# Altium schematic sheet connect.SchDoc
size A3
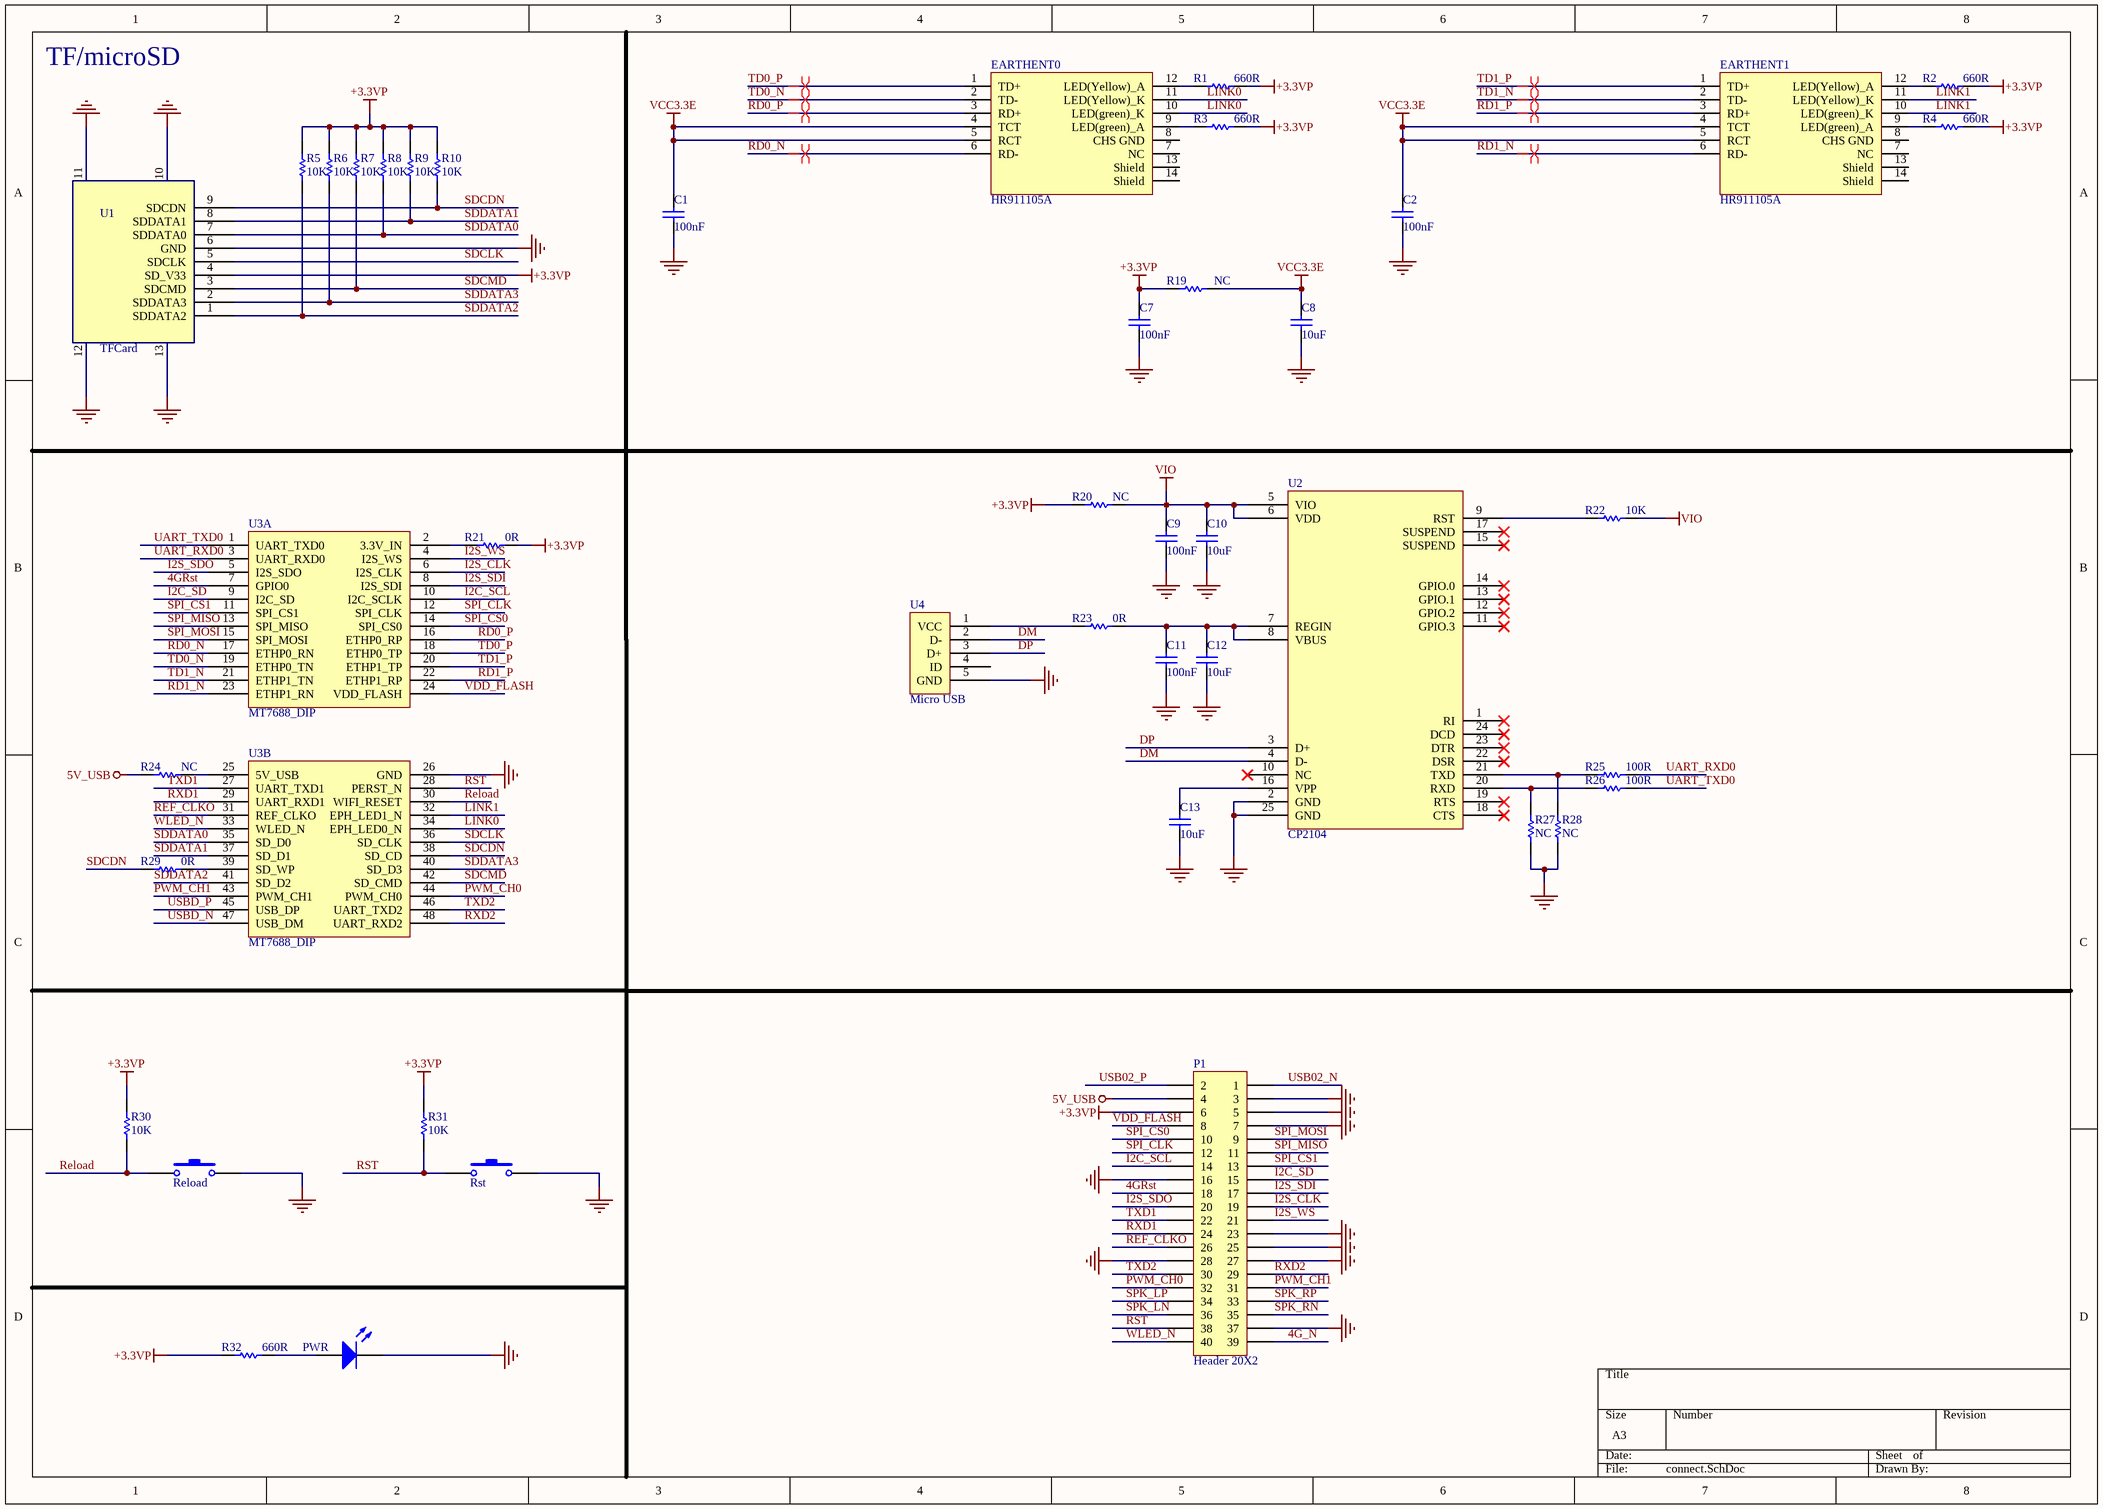
[diagram p0: connect.SchDoc]

## Parts
C1  value 100nF  [C0603L]  (hidden comment: Cap Semi)
C2  value 100nF  [C0603L]  (hidden comment: Cap Semi)
C7  value 100nF  [C0603L]  (hidden comment: Cap Semi)
C8  value 10uF  [C0603L]  (hidden comment: Cap Semi)
C9  value 100nF  [C0603L]  (hidden comment: Cap Semi)
C10  value 10uF  [C0603L]  (hidden comment: Cap Semi)
C11  value 100nF  [C0603L]  (hidden comment: Cap Semi)
C12  value 10uF  [C0603L]  (hidden comment: Cap Semi)
C13  value 10uF  [C0603L]  (hidden comment: Cap Semi)
EARTHENT0  HR911105A  [HR911105A]
EARTHENT1  HR911105A  [HR911105A]
P1  Header 20X2  [HDR2X20]
PWR  leds_0603  [0603LED]  (value not drawn)
R1  value 660R  [R0603L]  (hidden comment: Res Semi)
R2  value 660R  [R0603L]  (hidden comment: Res Semi)
R3  value 660R  [R0603L]  (hidden comment: Res Semi)
R4  value 660R  [R0603L]  (hidden comment: Res Semi)
R5  value 10K  [R0603L]  (hidden comment: Res Semi)
R6  value 10K  [R0603L]  (hidden comment: Res Semi)
R7  value 10K  [R0603L]  (hidden comment: Res Semi)
R8  value 10K  [R0603L]  (hidden comment: Res Semi)
R9  value 10K  [R0603L]  (hidden comment: Res Semi)
R10  value 10K  [R0603L]  (hidden comment: Res Semi)
R19  value NC  [R0603L]  (hidden comment: Res Semi)
R20  value NC  [R0603L]  (hidden comment: Res Semi)
R21  value 0R  [R0603L]  (hidden comment: Res Semi)
R22  value 10K  [R0603L]  (hidden comment: Res Semi)
R23  value 0R  [R0603L]  (hidden comment: Res Semi)
R24  value NC  [R0603L]  (hidden comment: Res Semi)
R25  value 100R  [R0603L]  (hidden comment: Res Semi)
R26  value 100R  [R0603L]  (hidden comment: Res Semi)
R27  value NC  [R0603L]  (hidden comment: Res Semi)
R28  value NC  [R0603L]  (hidden comment: Res Semi)
R29  value 0R  [R0603L]  (hidden comment: Res Semi)
R30  value 10K  [R0603L]  (hidden comment: Res Semi)
R31  value 10K  [R0603L]  (hidden comment: Res Semi)
R32  value 660R  [R0603L]  (hidden comment: Res Semi)
Reload  key  [2x3SWD]  (value not drawn)
Rst  key  [2x3SWD]  (value not drawn)
U1  TFCard  [TFCard-1]
U2  CP2104  [QFN24_4X4]
U3  MT7688_DIP  [MT7688_DIP]  (parts A,B of 2)
U4  Micro USB  [USB-15B1]

## Nets
5V_USB: P1.4 R24.2
+3.3VP: C7.1 P1.6 R1.1 R2.1 R3.1 R4.1 R5.2 R6.2 R7.2 R8.2 R9.2 R10.2 R19.2 R20.2 R21.1 R30.2 R31.2 R32.2 U1.4(SD_V33)
GND: C1.2 C2.2 C7.2 C8.2 C9.2 C10.2 C11.2 C12.2 C13.2 P1.3 P1.5 P1.7 P1.16 P1.23 P1.25 P1.27 P1.28 P1.37 PWR.2(K) R27.2 R28.2 Reload.1 Rst.1 U1.6(GND) U1.10 U1.11 U1.12 U1.13 U2.2(GND) U2.25(GND) U3.26(GND) U4.5(GND)
VCC3.3E: C1.1 C2.1 C8.1 EARTHENT0.4(TCT) EARTHENT0.5(RCT) EARTHENT1.4(TCT) EARTHENT1.5(RCT) R19.1
VIO: C9.1 C10.1 R20.1 R22.1 U2.5(VIO) U2.6(VDD)
4G_N: P1.39
4GRst: P1.18 U3.7(GPIO0)
DM: U2.4(D-) U4.2(D-)
DP: U2.3(D+) U4.3(D+)
I2C_SCL: P1.14 U3.10(I2C_SCLK)
I2C_SD: P1.15 U3.9(I2C_SD)
I2S_CLK: P1.19 U3.6(I2S_CLK)
I2S_SDI: P1.17 U3.8(I2S_SDI)
I2S_SDO: P1.20 U3.5(I2S_SDO)
I2S_WS: P1.21 U3.4(I2S_WS)
LINK0: EARTHENT0.10(LED(green)_K) EARTHENT0.11(LED(Yellow)_K) U3.34(EPH_LED0_N)
LINK1: EARTHENT1.10(LED(green)_K) EARTHENT1.11(LED(Yellow)_K) U3.32(EPH_LED1_N)
PWM_CH0: P1.32 U3.44(PWM_CH0)
PWM_CH1: P1.31 U3.43(PWM_CH1)
RD0_N: EARTHENT0.6(RD-) U3.17(ETHP0_RN)
RD0_P: EARTHENT0.3(RD+) U3.16(ETHP0_RP)
RD1_N: EARTHENT1.6(RD-) U3.23(ETHP1_RN)
RD1_P: EARTHENT1.3(RD+) U3.22(ETHP1_RP)
REF_CLKO: P1.26 U3.31(REF_CLKO)
Reload: R30.1 Reload.2 U3.30(WIFI_RESET)
RST: P1.38 R31.1 Rst.2 U3.28(PERST_N)
RXD1: P1.24 U3.29(UART_RXD1)
RXD2: P1.29 U3.48(UART_RXD2)
SDCDN: R10.1 R29.2 U1.9(SDCDN) U3.38(SD_CD)
SDCLK: U1.5(SDCLK) U3.36(SD_CLK)
SDCMD: R7.1 U1.3(SDCMD) U3.42(SD_CMD)
SDDATA0: R8.1 U1.7(SDDATA0) U3.35(SD_D0)
SDDATA1: R9.1 U1.8(SDDATA1) U3.37(SD_D1)
SDDATA2: R5.1 U1.1(SDDATA2) U3.41(SD_D2)
SDDATA3: R6.1 U1.2(SDDATA3) U3.40(SD_D3)
SPI_CLK: P1.12 U3.12(SPI_CLK)
SPI_CS0: P1.10 U3.14(SPI_CS0)
SPI_CS1: P1.13 U3.11(SPI_CS1)
SPI_MISO: P1.11 U3.13(SPI_MISO)
SPI_MOSI: P1.9 U3.15(SPI_MOSI)
SPK_LN: P1.36
SPK_LP: P1.34
SPK_RN: P1.35
SPK_RP: P1.33
TD0_N: EARTHENT0.2(TD-) U3.19(ETHP0_TN)
TD0_P: EARTHENT0.1(TD+) U3.18(ETHP0_TP)
TD1_N: EARTHENT1.2(TD-) U3.21(ETHP1_TN)
TD1_P: EARTHENT1.1(TD+) U3.20(ETHP1_TP)
TXD1: P1.22 U3.27(UART_TXD1)
TXD2: P1.30 U3.46(UART_TXD2)
UART_RXD0: R25.1 U3.3(UART_RXD0)
UART_TXD0: R26.1 U3.1(UART_TXD0)
USB02_N: P1.1
USB02_P: P1.2
USBD_N: U3.47(USB_DM)
USBD_P: U3.45(USB_DP)
VDD_FLASH: P1.8 U3.24(VDD_FLASH)
WLED_N: P1.40 U3.33(WLED_N)
NetC11_1: C11.1 C12.1 R23.1 U2.7(REGIN) U2.8(VBUS)
NetC13_1: C13.1 U2.16(VPP)
NetEARTHENT0_9: EARTHENT0.9(LED(green)_A) R3.2
NetEARTHENT0_12: EARTHENT0.12(LED(Yellow)_A) R1.2
NetEARTHENT1_9: EARTHENT1.9(LED(green)_A) R4.2
NetEARTHENT1_12: EARTHENT1.12(LED(Yellow)_A) R2.2
NetPWR_1: PWR.1(A) R32.1
NetR21_2: R21.2 U3.2(3.3V_IN)
NetR22_2: R22.2 U2.9(RST)
NetR23_2: R23.2 U4.1(VCC)
NetR24_1: R24.1 U3.25(5V_USB)
NetR25_2: R25.2 R28.1 U2.21(TXD)
NetR26_2: R26.2 R27.1 U2.20(RXD)
NetR29_1: R29.1 U3.39(SD_WP)

Not connected (* = marked no-connect by the designer): EARTHENT0 7(NC) 8(CHS_GND) 13(Shield) 14(Shield); EARTHENT1 7(NC) 8(CHS_GND) 13(Shield) 14(Shield); U2 1(RI)* 10(NC)* 11(GPIO.3)* 12(GPIO.2)* 13(GPIO.1)* 14(GPIO.0)* 15(SUSPEND)* 17(SUSPEND)* 18(CTS)* 19(RTS)* 22(DSR)* 23(DTR)* 24(DCD)*; U4 4(ID)

## Layout directives
differential pair: RD0_N, RD0_P, RD1_N, RD1_P, TD0_N, TD0_P, TD1_N, TD1_P

## Notes on the sheet
- TF/microSD

## Library data of the parts
C1 C2 C7-C13 = Cap Semi: Capacitor (Semiconductor SIM Model); Published: 8-Jun-2000; LatestRevisionDate: 17-Jul-2002; LatestRevisionNote: Re-released for DXP Platform.; PackageReference: C1206; Publisher: Altium Limited
EARTHENT0 EARTHENT1 = HR911105A: Pb-free,接线端子,KF102-3.81-2,2引脚,间距:3.81mm,绿色,额定电压:300V,电流10A,接触电阻：20mΩ,绝缘电阻 5000Ω/1000V,耐压:AC1500V\1min,-40~105℃; Part Number: 3DZ0105115; Specification: Pb-free,接线端子,KF102-3.81-2,2引脚,间距:3.81mm,绿色,额定电压:300V,电流10A,接触电阻：20mΩ,绝缘电阻 5000Ω/1000V,耐压:AC1500V\1min,-40~105℃; Value: *
P1 = Header 20X2: Header, 20-Pin, Dual row; LatestRevisionDate: 17-Jul-2002; LatestRevisionNote: Re-released for DXP Platform.; Publisher: Altium Limited
R1-R10 R19-R32 = Res Semi: Semiconductor Resistor; Published: 8-Jun-2000; LatestRevisionDate: 17-Jul-2002; LatestRevisionNote: Re-released for DXP Platform.; PackageReference: AXIAL-0.5; Publisher: Altium Limited
U4 = USB mini-b